# EAGLE design latch7 (EAGLE 8.3.1)
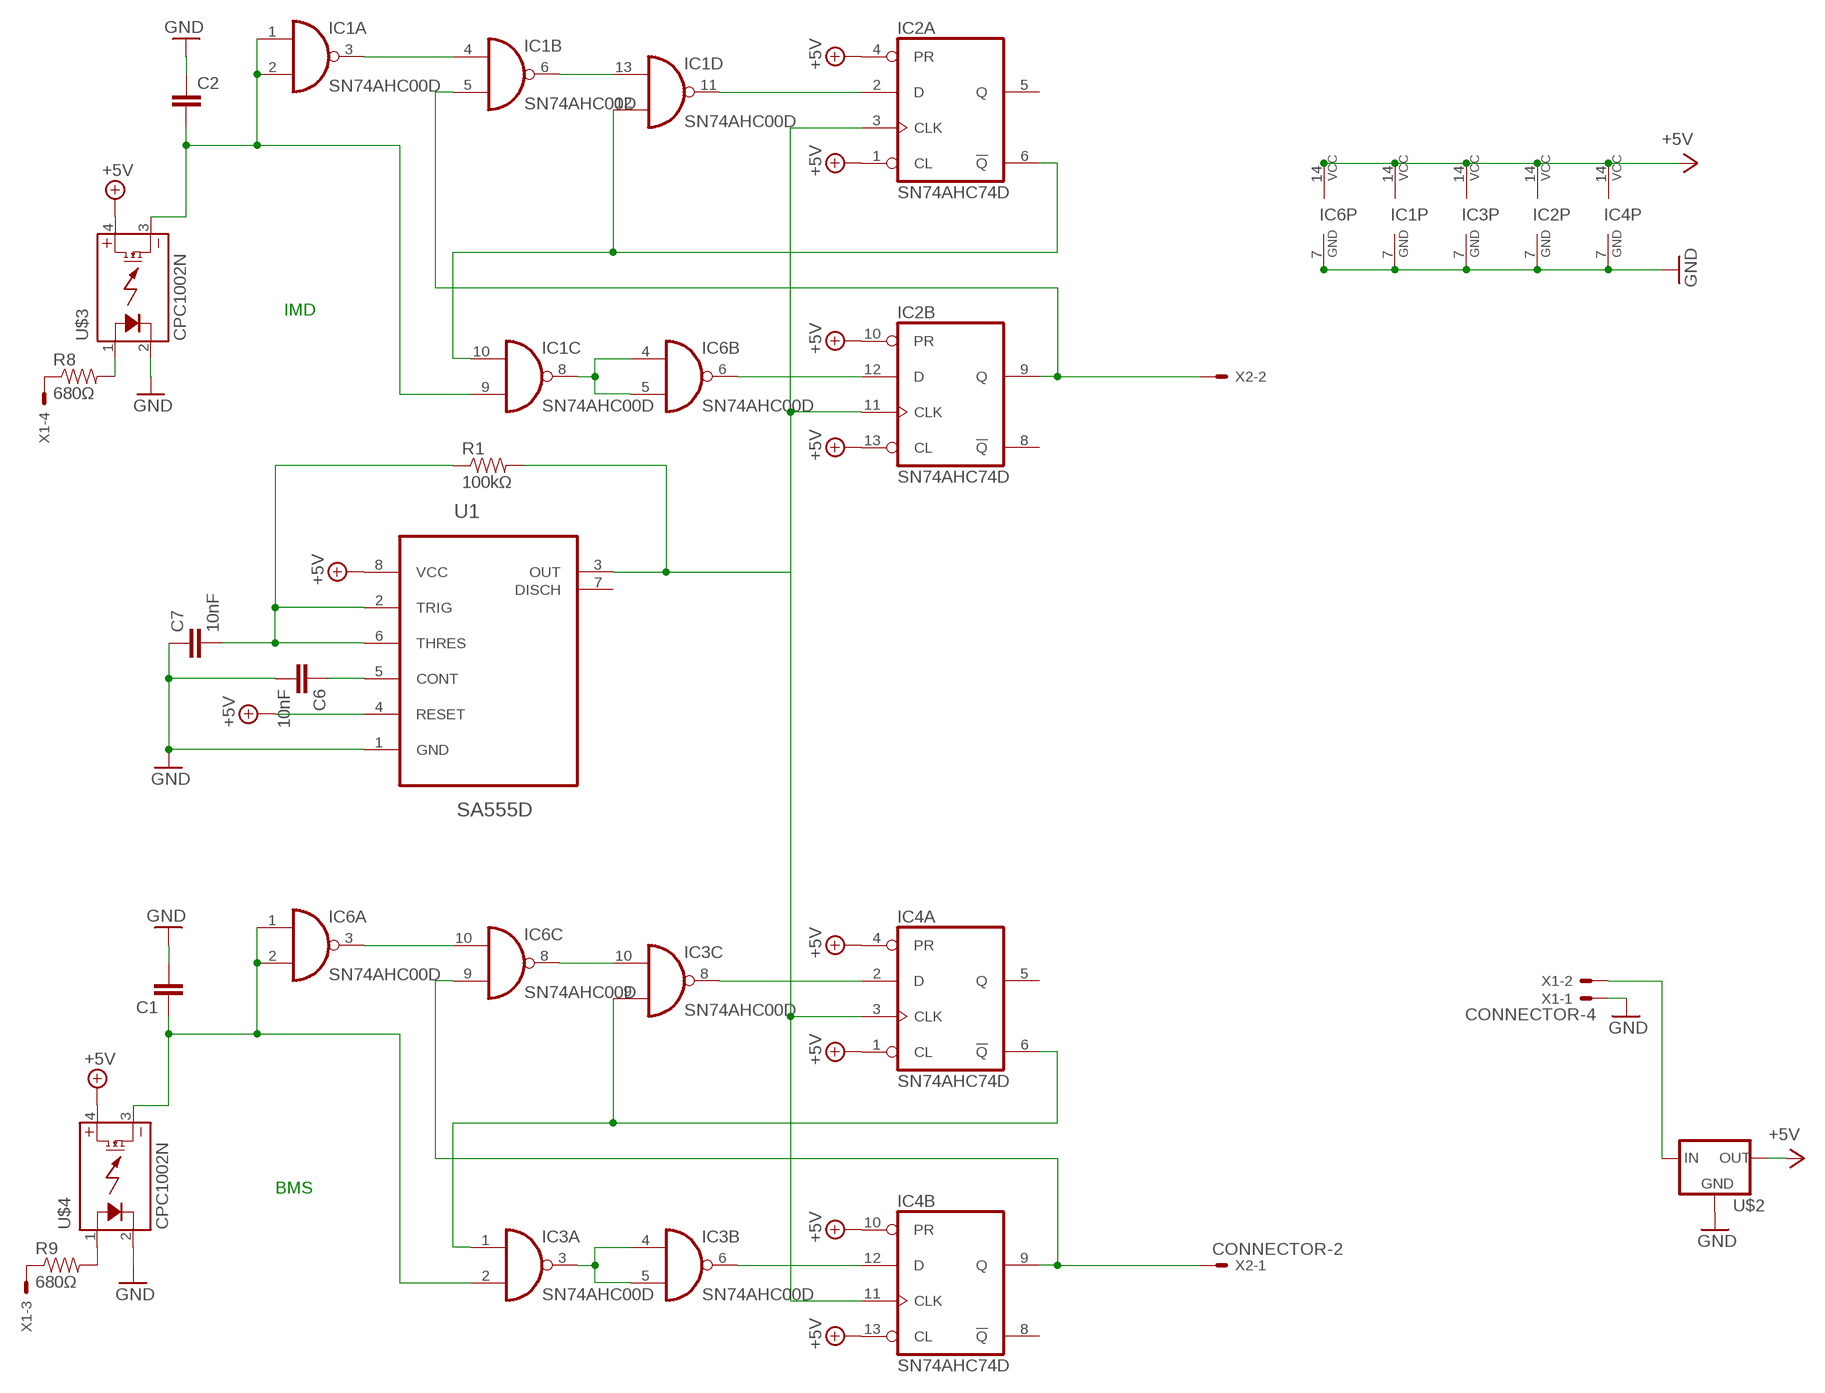
[diagram p0: schematic, sheet 1]

## Parts
C1  CAP0402-CAP  [0402-CAP]
C2  CAP0402-CAP  [0402-CAP]
C6  10nF  CAP0402-CAP  [0402-CAP]
C7  10nF  CAP0402-CAP  [0402-CAP]
IC1  SN74AHC00D  [SOIC-14]
IC2  SN74AHC74D  [SOIC-14]
IC3  SN74AHC00D  [SOIC-14]
IC4  SN74AHC74D  [SOIC-14]
IC6  SN74AHC00D  [SOIC-14]
R1  100kΩ  RESISTOR0402  [0402-RES]
R8  680Ω  RESISTOR0402  [0402-RES]
R9  680Ω  RESISTOR0402  [0402-RES]
U1  SA555D  [SOIC127P600X175-8N]
U$2  5VREG_LM340-NLM340MPX-5.0/NOPB  [SOT223]
U$3  CPC1002N  [SOP04]
U$4  CPC1002N  [SOP04]
X1  CONNECTOR-4  [MINIFIT_5566-4]
X2  CONNECTOR-2  [MINIFIT_5566-2]

## Nets
12V: U$2.1(IN) X1.2
+5V: IC1.14(P:VCC) IC2.1(A:CL) IC2.4(A:PR) IC2.10(B:PR) IC2.13(B:CL) IC2.14(P:VCC) IC3.14(P:VCC) IC4.1(A:CL) IC4.4(A:PR) IC4.10(B:PR) IC4.13(B:CL) IC4.14(P:VCC) IC6.14(P:VCC) U1.4(RESET) U1.8(VCC) U$2.3(OUT) U$3.4(DC+) U$4.4(DC+)
BMS_5V: C1.1 IC3.2(A:I1) IC6.1(A:I0) IC6.2(A:I1) U$4.3(DC-)
BMS_IN: R9.2 U$4.1(CONTROL+)
BMS_OUT: IC4.9(B:Q) IC6.9(C:I1) X2.1
GND: C1.2 C2.1 C6.2 C7.1 IC1.7(P:GND) IC2.7(P:GND) IC3.7(P:GND) IC4.7(P:GND) IC6.7(P:GND) U1.1(GND) U$2.2(GND) U$2.4(GND) U$3.2(CONTROL-) U$4.2(CONTROL-) X1.1
IMD_5V: C2.2 IC1.1(A:I0) IC1.2(A:I1) IC1.9(C:I1) U$3.3(DC-)
IMD_IN: R8.2 U$3.1(CONTROL+)
IMD_OUT: IC1.5(B:I1) IC2.9(B:Q) X2.2
N$1: IC2.3(A:CLK) IC2.11(B:CLK) IC4.3(A:CLK) IC4.11(B:CLK) R1.2 U1.3(OUT)
N$2: IC1.3(A:O) IC1.4(B:I0)
N$3: C7.2 R1.1 U1.2(TRIG) U1.6(THRES)
N$4: IC1.6(B:O) IC1.13(D:I0)
N$5: IC1.10(C:I0) IC1.12(D:I1) IC2.6(A:!Q)
N$6: IC1.11(D:O) IC2.2(A:D)
N$8: IC2.12(B:D) IC6.6(B:O)
N$9: C6.1 U1.5(CONT)
N$10: IC3.6(B:O) IC4.12(B:D)
N$11: IC1.8(C:O) IC6.4(B:I0) IC6.5(B:I1)
N$20: IC6.3(A:O) IC6.10(C:I0)
N$21: IC3.10(C:I0) IC6.8(C:O)
N$22: IC3.1(A:I0) IC3.9(C:I1) IC4.6(A:!Q)
N$23: IC3.8(C:O) IC4.2(A:D)
N$25: IC3.3(A:O) IC3.4(B:I0) IC3.5(B:I1)
N$32: R8.1 X1.4
N$33: R9.1 X1.3
Unconnected: IC2.5(A:Q) IC2.8(B:!Q) IC3.11(D:O) IC3.12(D:I1) IC3.13(D:I0) IC4.5(A:Q) IC4.8(B:!Q) IC6.11(D:O) IC6.12(D:I1) IC6.13(D:I0) U1.7(DISCH)

## Notes on the sheet
- IMD
- BMS

## Library data of the parts
C1 C2 C6 C7 = HyTechDevices:CAP: Capacitor Standard 0603 ceramic capacitor, and 0.1" leaded capacitor.
IC1 IC3 IC6 = HyTechDevices:SN74AHC00: TI SN74AHC00 Quadruple 2-input NAND
IC2 IC4 = HyTechDevices:SN74AHC74: TI SN74AHC74 Dual positive edge triggered D-type FLIP FLOP
R1 R8 R9 = HyTechDevices:RESISTOR: Resistor Basic schematic elements and footprints for 0603, 1206, and PTH resistors.
U1 = Texas Instruments:SA555D: PRECISION TIMERS; MPN: SA555D; OC_FARNELL: 9589945; OC_NEWARK: 75C7630; PACKAGE: SOIC-8; SUPPLIER: Texas Instruments
U$2 = HyTechDevices:5VREG_LM340-N: Voltage Regulator 5v linear voltage regulator Datasheet <http://www.mouser.com/ProductDetail/Texas-Instruments/LM340MPX-50-NOPB/?qs=X1J7HmVL2ZGZwtTFRQ9ItA%3D%3D> MAX current out: 1.5A MAX voltage in: 35V
U$3 U$4 = HyTechDevices:CPC1002N: IXYS Solid State Relay .7A
X1 = HyTechDevices:CONNECTOR-4: Mini-Fit Junior connector 4 pole Source: http://www.molex.com; OC_FARNELL: unknown; OC_NEWARK: unknown
X2 = HyTechDevices:CONNECTOR-2: Mini-Fit Junior connector 2 pole Source: http://www.molex.com; OC_FARNELL: 1822072; OC_NEWARK: unknown

## Board
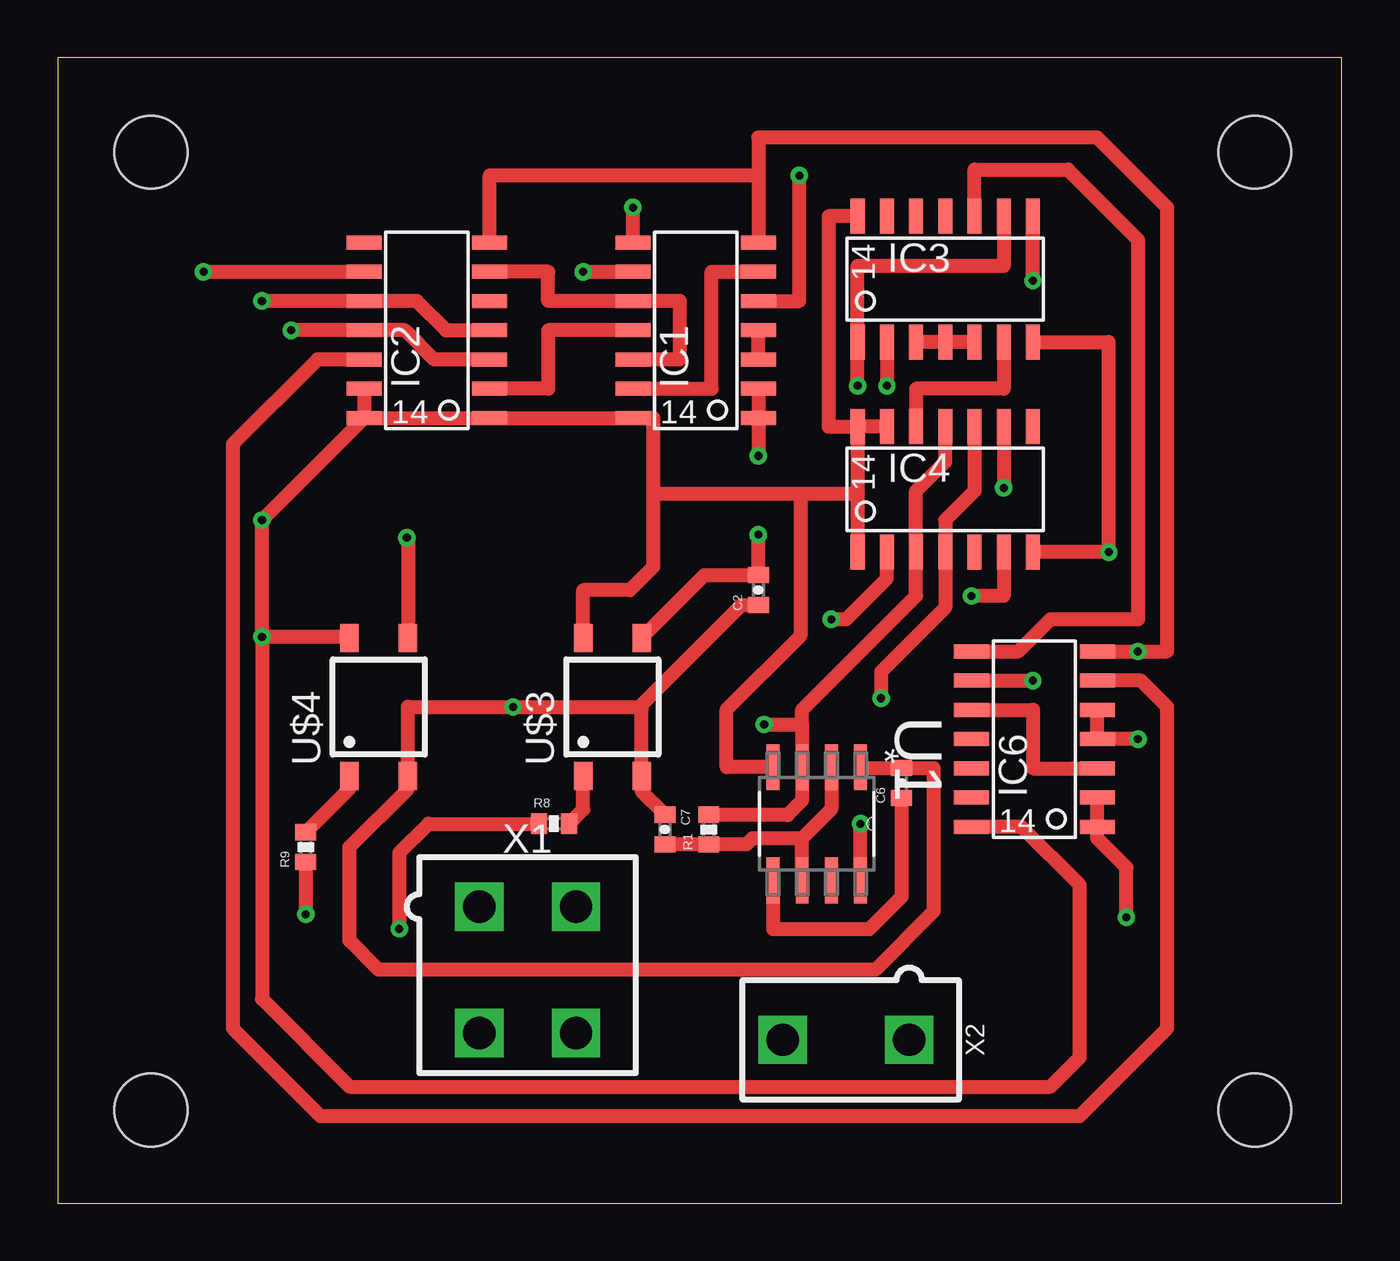
[diagram p1: board, top side]
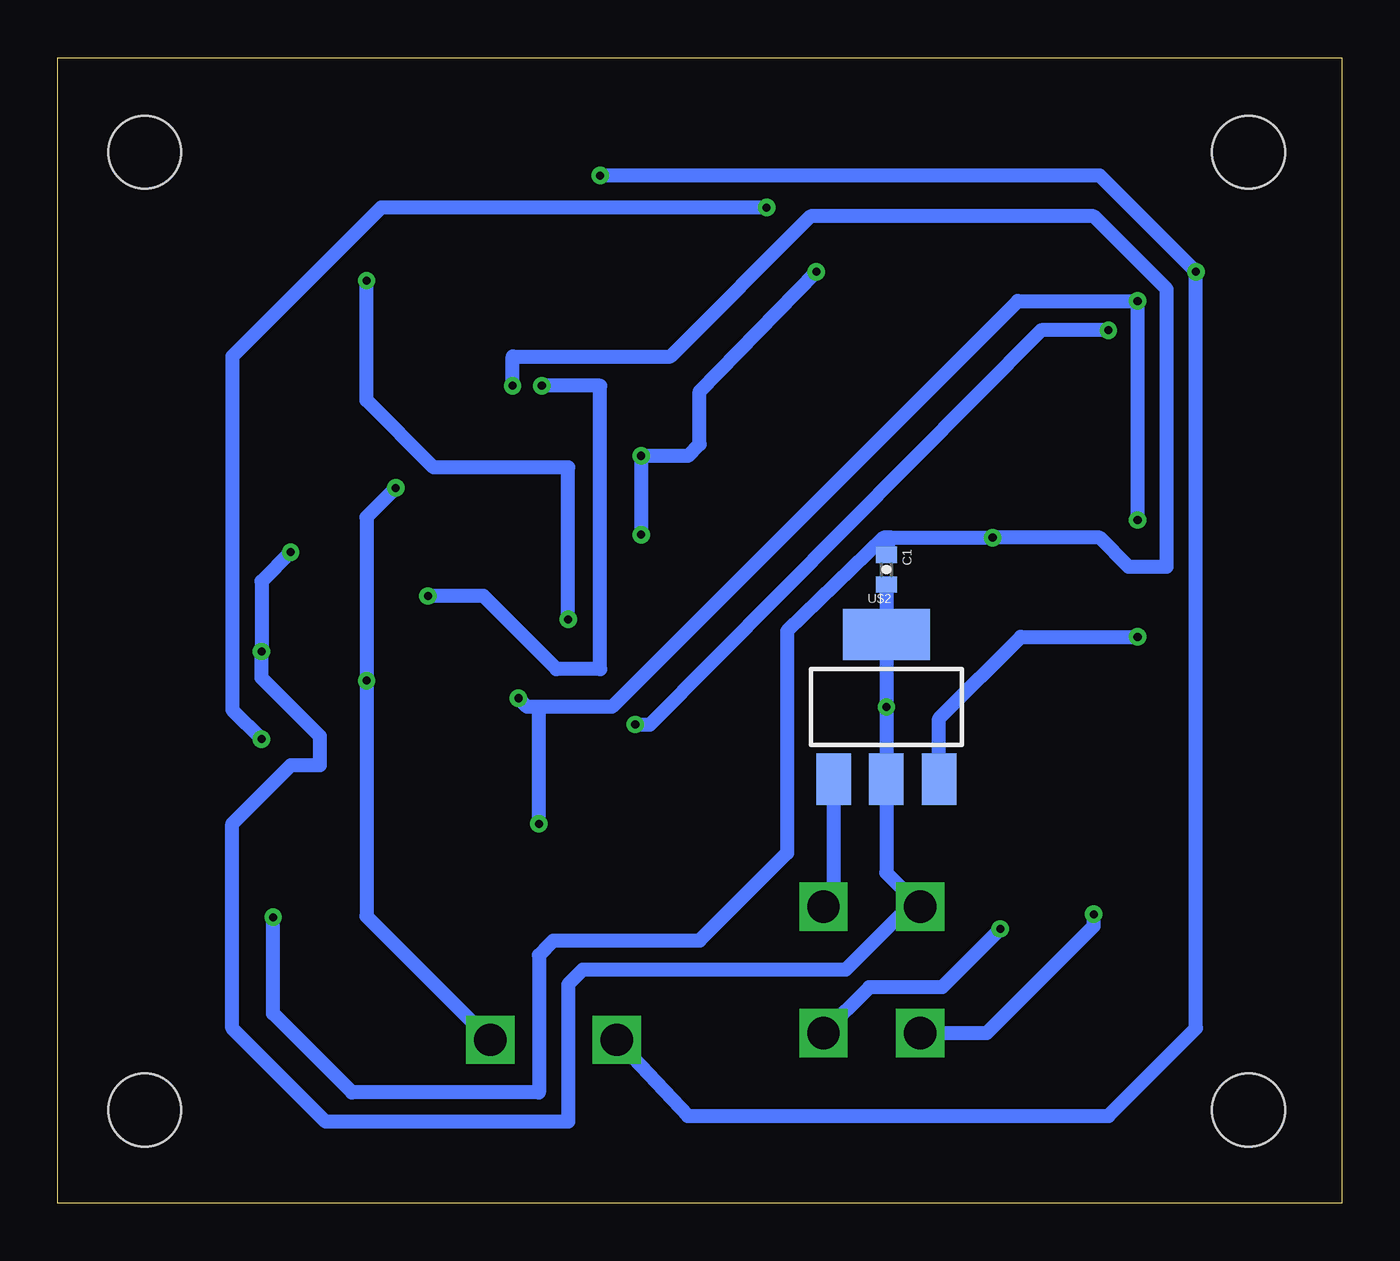
[diagram p2: board, bottom side, seen from below]

Size 55.86 x 49.84 mm. Coordinates in mm from the lower left corner, seen from the top.
Outline: 0,0 55.86,0 55.86,49.84 0,49.84 0,0
Copper layers (1*16): Top 0.035mm / dielectric 1.5mm / Bottom 0.035mm
Design rules "default *": minimum track width 6mil, minimum drill 0.35mm, track to track 16mil, track to pad 16mil, pad to pad 16mil, via to via 16mil, smd to smd 16mil, copper to edge 40mil, drill to drill 6mil, minimum pad ring 10mil, minimum via ring 8mil, stop-mask expansion 4mil, vias tented up to drill 0mil, thermal gap 10mil
Holes 3.17 mm at 4.06,4.06 4.06,45.72 52.07,45.72 52.07,4.06

### Footprints (pad centres in the part's own frame; a part is rotated, then mirrored left to right if it is on the bottom)
0402-CAP = smd 0.7 x 0.9: 1 -0.65,0; 2 0.65,0
SOIC-14 = smd 0.61 x 1.524: 1 -4.445,-2.794; 2 -3.175,-2.794; 3 -1.905,-2.794; 4 -0.635,-2.794; 5 0.635,-2.794; 6 1.905,-2.794; 7 3.175,-2.794; 8 3.175,2.667; 9 1.905,2.667; 10 0.635,2.667; 11 -0.635,2.667; 12 -1.905,2.667; 13 -3.175,2.667; 14 -4.445,2.667
0402-RES = smd 0.7 x 0.9: 1 -0.65,0; 2 0.65,0
SOIC127P600X175-8N = smd 1.981 x 0.559: 1 -2.464,1.905; 2 -2.464,0.635; 3 -2.464,-0.635; 4 -2.464,-1.905; 5 2.464,-1.905; 6 2.464,-0.635; 7 2.464,0.635; 8 2.464,1.905
SOT223 = smd 1.5 x 2.235: 1 -2.3,-3.15; 2 0,-3.15; 3 2.3,-3.15 | smd 3.8 x 2.2: 4 0,3.15
SOP04 = smd 0.8 x 1.2: 1 -1.27,-3; 2 1.27,-3; 3 1.27,3; 4 -1.27,3
MINIFIT_5566-4 = drill 1.4 square: 1 2.1,-2.75; 2 -2.1,-2.75; 3 2.1,2.75; 4 -2.1,2.75
MINIFIT_5566-2 = drill 1.4 square: 1 0,-2.75; 2 0,2.75

### Placement (x,y rotation side)
C1  19.81,27.56 270 bottom
C2  30.48,26.67 90 top
C6  36.7,18.29 90 top
C7  26.42,16.26 270 top
IC1  27.69,38.61 90 top
IC2  16,38.61 90 top
IC3  39.24,40.26 0 top
IC4  39.24,31.11 0 top
IC6  42.42,20.83 90 top
R1  28.32,16.26 90 top
R8  21.59,16.51 0 top
R9  10.79,15.49 90 top
U1  33.02,16.51 270 top
U$2  19.81,21.59 0 bottom
U$3  24.13,21.59 0 top
U$4  13.97,21.59 0 top
X1  20.45,10.16 180 top
X2  34.29,7.11 90 top

### Tracks (layer width: path | path; a pad name or v marks a point on that pad's centre or on a via)
12V
  Bottom 0.61: U$2.1 22.11,13.35 X1.2
+5V  (via drill 0.35)
  Top 0.61: 22.81,24.64 U$3.4 22.86,26.67 24.89,26.67 25.91,27.69 25.91,30.86 | IC4.13 IC4.14 | IC2.13 IC2.14 | IC2.4 16.89,37.97 15.62,39.24 IC2.10 v8.89,39.24 | IC2.14 IC2.1 IC1.14 25.91,34.16 25.91,30.86 | IC2.14 v8.89,29.72 v8.89,24.64 | IC3.14 33.53,42.93 33.53,33.78 IC4.14 | IC4.10 39.88,30.99 38.61,29.72 IC4.4 38.61,25.91 35.81,23.11 v35.81,21.97 | v8.89,24.64 8.89,8.89 12.7,5.08 43.18,5.08 44.45,6.35 44.45,13.84 41.91,16.38 IC6.14 | IC4.14 34.8,30.86 | 34.8,30.86 IC4.1 | 32.3,30.86 34.8,30.86 | 32.3,30.86 32.3,24.68 29.1,21.48 29.1,18.97 U1.4 31.11,19.05 | U1.8 v34.92,16.51 | U$4.4 12.65,24.64 v8.89,24.64 | 25.91,30.86 32.3,30.86
  Bottom 0.61: v8.89,24.64 13.97,24.64 17.53,21.08 17.53,18.45 U$2.3 | v8.89,29.72 v8.89,39.24 14.1,39.24 31.75,21.59 34.92,21.59 | v35.81,21.97 35.43,21.59 34.92,21.59 | v34.92,16.51 34.92,21.59
BMS_5V  (via drill 0.35)
  Top 0.61: IC3.2 v36.07,35.56 | IC6.2 IC6.1 45.21,15.88 46.48,14.61 v46.48,12.45 | v15.19,28.96 15.22,28.96 15.24,28.94 U$4.3
  Bottom 0.61: v36.07,35.56 36.07,36.83 29.21,36.83 23.11,42.93 10.79,42.93 7.62,39.75 7.62,27.69 9.27,27.69 10.54,28.96 v15.19,28.96 19.63,28.96 | 19.63,28.96 19.94,28.96 24.13,24.89 24.13,15.24 27.94,11.43 34.29,11.43 | 19.78,28.94 C1.1 19.65,28.97 19.63,28.96 | 34.67,11.05 34.29,11.43 | 34.29,11.43 34.92,10.79 34.92,4.83 43.05,4.83 46.48,8.26 v46.48,12.45
BMS_IN
  Top 0.61: U$4.1 12.7,18.05 R9.2
BMS_OUT  (via drill 0.35)
  Top 0.61: IC4.9 v41.15,31.11 | IC6.9 v42.42,22.73
  Bottom 0.61: v41.15,31.11 42.42,29.84 v42.42,22.73 42.42,12.49 X2.1
GND  (via drill 0.35)
  Top 0.61: U$3.2 25.4,19.05 | IC3.7 45.72,37.47 v45.72,28.32 IC4.7 | IC6.7 v46.99,24 48.26,24 48.26,43.31 45.21,46.35 30.48,46.35 30.48,44.7 | IC2.7 18.8,44.7 30.48,44.7 | 30.48,44.7 IC1.7 | 25.31,21.59 v19.81,21.59 15.24,21.59 U$4.2 15.24,18.03 12.7,15.49 12.7,11.43 13.97,10.16 35.56,10.16 38.1,12.7 38.1,18.94 C6.2 34.96,18.94 U1.1 34.92,18.94 | U$3.2 25.4,21.5 25.31,21.59 | 25.31,21.59 29.74,26.02 C2.1 | C7.1 25.4,17.92 U$3.2
  Bottom 0.61: v45.72,28.32 46.99,27.05 v46.99,24 46.99,22.86 44.45,20.32 44.45,19.05 45.72,19.05 48.26,16.51 48.26,7.62 44.2,3.56 33.66,3.56 33.66,9.53 33.02,10.16 21.59,10.16 18.84,12.91 X1.1 19.81,14.38 U$2.2 v19.81,21.59 U$2.4 C1.2
IMD_5V  (via drill 0.35)
  Top 0.61: 25.41,24.59 U$3.3 | U$3.3 25.4,24.64 | 25.41,24.88 25.41,24.59 | 25.46,24.64 25.41,24.59 | U$3.3 26.44,25.63 26.83,26.02 28.13,27.32 C2.2 v30.48,29.08 | v22.86,40.51 IC1.9 | IC1.2 IC1.1 v30.48,32.51
  Bottom 0.61: v22.86,40.51 27.94,35.31 27.94,33.02 28.45,32.51 v30.48,32.51 v30.48,29.08
IMD_IN
  Top 0.61: R8.2 22.86,17.13 U$3.1
IMD_OUT  (via drill 0.35)
  Top 0.61: v6.35,40.51 IC2.9 | IC1.5 32.26,39.24 v32.26,44.7
  Bottom 0.61: v32.26,44.7 10.54,44.7 v6.35,40.51 6.35,7.62 10.16,3.81 28.45,3.81 X2.2
N$1  (via drill 0.35)
  Top 0.61: IC2.3 16.38,36.7 15.11,37.97 IC2.11 v10.16,37.97 | IC4.11 38.61,32.26 37.34,30.99 IC4.3 37.34,26.42 32.38,21.46 32.38,20.76 | 32.38,20.76 U1.3 32.38,17.53 31.75,16.89 31.73,16.91 R1.2 | 32.38,20.76 arc90 32.32,20.83 v30.73,20.83
  Bottom 0.61: v10.16,37.97 13.08,37.97 30.1,20.83 v30.73,20.83
N$2
  Top 0.61: IC1.3 IC1.4
N$3
  Top 0.61: U1.2 33.66,17.14 32.38,15.88 | U1.6 32.38,15.88 | 32.38,15.88 30.23,15.88 29.97,15.62 28.34,15.62 R1.1 C7.2
N$4
  Top 0.61: IC1.13 28.45,35.43 28.45,40.51 IC1.6
N$5
  Top 0.61: IC1.12 27.05,36.7 27.05,39.24 IC1.10 21.34,39.24 21.34,40.51 IC2.6
N$6
  Top 0.61: IC1.11 21.34,37.97 21.34,35.43 IC2.2
N$8
  Top 0.61: IC6.6 47.12,22.73 48.26,21.59 48.26,7.62 44.45,3.81 11.43,3.81 7.62,7.62 7.62,33.02 11.3,36.7 IC2.12
N$9
  Top 0.61: U1.5 31.11,11.94 35.31,11.94 36.7,13.34 C6.1
N$10
  Top 0.61: IC3.6 41.15,35.43 37.34,35.43 IC4.12
N$11  (via drill 0.35)
  Top 0.61: IC6.5 IC6.4 v46.99,20.19 | IC1.8 v25.02,43.31
  Bottom 0.61: v25.02,43.31 41.78,43.31 48.26,36.83 48.26,21.46 v46.99,20.19
N$20
  Top 0.61: IC6.10 42.42,21.46 42.42,18.92 IC6.3
N$21
  Top 0.61: IC3.10 39.88,44.96 43.94,44.96 46.99,41.91 46.99,25.4 43.18,25.4 41.78,24 IC6.8
N$22  (via drill 0.35)
  Top 0.61: IC3.9 41.15,40.77 34.8,40.77 IC3.1 v34.8,35.56 | IC4.6 41.15,26.42 v39.75,26.42
  Bottom 0.61: v34.8,35.56 32.26,35.56 32.26,23.24 34.16,23.24 37.34,26.42 v39.75,26.42
N$23  (via drill 0.35)
  Top 0.61: IC4.2 36.07,27.18 34.29,25.4 v33.66,25.4 | v42.42,40.13 IC3.8
  Bottom 0.61: v33.66,25.4 33.66,32 39.5,32 42.42,34.92 v42.42,40.13
N$25
  Top 0.61: IC3.3 IC3.4 IC3.5
N$32  (via drill 0.35)
  Top 0.61: v14.86,11.94 14.86,15.24 16.13,16.51 R8.1
  Bottom 0.61: X1.4 20.56,9.4 17.4,9.4 v14.86,11.94
N$33  (via drill 0.35)
  Top 0.61: v10.78,12.57 v10.79,12.57 R9.1
  Bottom 0.61: v10.79,12.57 10.79,12.06 15.45,7.41 X1.3